# Altium schematic sheet sch.SchDoc
size A
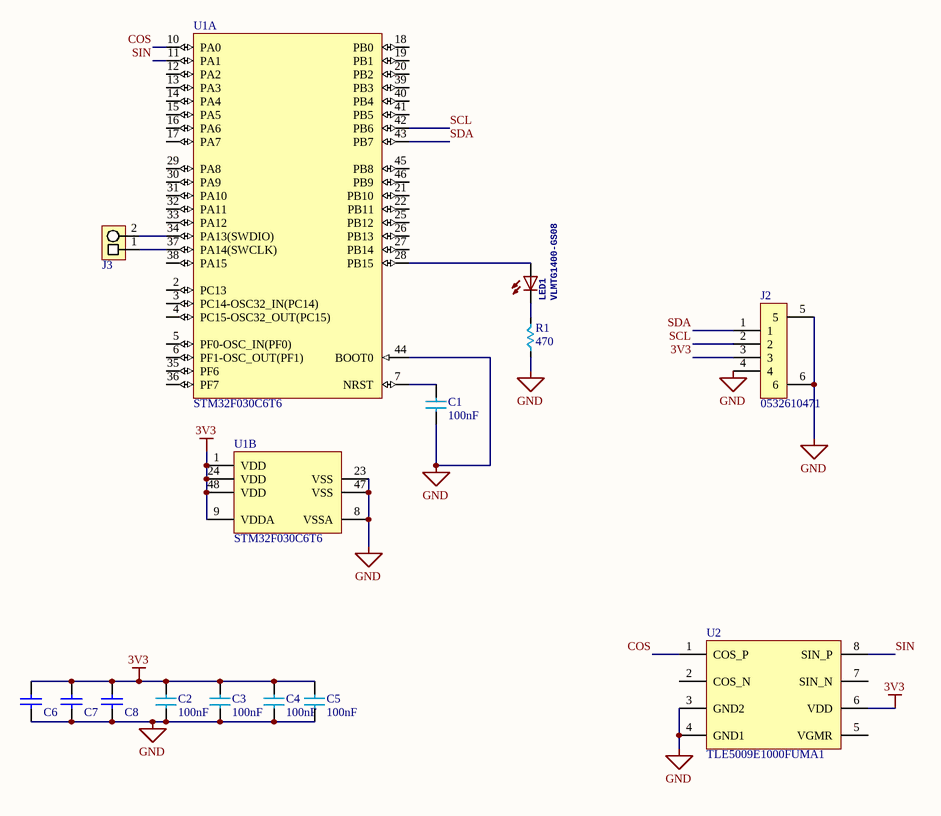
[diagram p0: sch.SchDoc]

## Parts
C1  100nF  [c0402]
C2  100nF  [c0402]
C3  100nF  [c0402]
C4  100nF  [c0402]
C5  100nF  [c0402]
C6  4.7uF  [C0603]  (value not drawn)
C7  4.7uF  [C0603]  (value not drawn)
C8  4.7uF  [C0603]  (value not drawn)
J2  0532610471  [0532610471]
J3  PIN-DUAL  [PAD-DOUBLE]  (value not drawn)
LED1  VLMTG1400-GS08  [LED_0603]
R1  470  [R0402]
U1  STM32F030C6T6  [LQFP48]  (parts A,B of 2)
U2  TLE5009E1000FUMA1  [SOIC127P600X175-8L]

## Nets
3V3: C2.1 C3.1 C4.1 C5.1 C6.2 C7.2 C8.2 J2.3 U1.1(VDD) U1.9(VDDA) U1.24(VDD) U1.48(VDD) U2.6(VDD)
GND: C1.2 C2.2 C3.2 C4.2 C5.2 C6.1 C7.1 C8.1 J2.4 J2.5 J2.6 R1.2 U1.8(VSSA) U1.23(VSS) U1.44(BOOT0) U1.47(VSS) U2.3(GND2) U2.4(GND1)
COS: U1.10(PA0) U2.1(COS_P)
SCL: J2.2 U1.42(PB6)
SDA: J2.1 U1.43(PB7)
SIN: U1.11(PA1) U2.8(SIN_P)
NetC1_1: C1.1 U1.7(NRST)
NetJ3_1: J3.1 U1.37(PA14(SWCLK))
NetJ3_2: J3.2 U1.34(PA13(SWDIO))
NetLED1_A: LED1.A U1.28(PB15)
NetLED1_C: LED1.C R1.1

Not connected (* = marked no-connect by the designer): U1 2(PC13) 3(PC14-OSC32_IN(PC14)) 4(PC15-OSC32_OUT(PC15)) 5(PF0-OSC_IN(PF0)) 6(PF1-OSC_OUT(PF1)) 12(PA2) 13(PA3) 14(PA4) 15(PA5) 16(PA6) 17(PA7) 18(PB0) 19(PB1) 20(PB2) 21(PB10) 22(PB11) 25(PB12) 26(PB13) 27(PB14) 29(PA8) 30(PA9) 31(PA10) 32(PA11) 33(PA12) 35(PF6) 36(PF7) 38(PA15) 39(PB3) 40(PB4) 41(PB5) 45(PB8) 46(PB9); U2 2(COS_N) 5(VGMR) 7(SIN_N)

## Notes on the sheet
- Title
- Size:
- Date:
- A
- Number:
- Time:
- Revision:
- Sheet
- of
- File:

## Library data of the parts
C1-C5 = C0402-100nF: SAMSUNG ELECTRO-MECHANICS - CL05F104ZO5NNNC - SMD Multilayer Ceramic Capacitor, 0.1 µF, 16 V, 0402 [1005 Metric], +80%, -20%, Y5V, CL Series; Tolerance: 80%; Voltage Rating: 16V; Supplier 1: Digi-Key; Supplier Part Number 1: 1276-1004-1-ND; Manufacturer: Samsung; Manufacturer Part Number: CL05F104ZO5NNNC; Mount: Surface Mount; Case/Package: 0402; Case Code (Metric): 1005; Case Code (Imperial): 0402; Material: Ceramic; Contact Plating: Tin; Min Operating Temperature: -30°C; Max Operating Temperature: 85°C; Capacitance: 100nF; Dielectric: Y5V; Packaging: Tape and Reel; Length: 1mm; Height: 0.5mm; Width: 0.02inch; Thickness: 0.022inch; Depth: 0.5mm; Radiation Hardening: No; ComponentLink1URL: https://datasheet.ciiva.com/16199/cl05f104zo5nnnc-16199056.pdf?src-supplier=Future+Electronics; ComponentLink1Description: https://datasheet.ciiva.com/16199/cl05f104zo5nnnc-16199056.pdf?src-supplier=Future+Electronics; ComponentLink2URL: https://datasheet.ciiva.com/15195/getdatasheetpartid-358403-15195703.pdf?src-supplier=Verical; ComponentLink2Description: https://datasheet.ciiva.com/15195/getdatasheetpartid-358403-15195703.pdf?src-supplier=Verical; ComponentLink3URL: https://datasheet.ciiva.com/29198/458504-da-01-en-vs-kondensator-0402-29198386.pdf?src-supplier=Conrad; ComponentLink3Description: https://datasheet.ciiva.com/29198/458504-da-01-en-vs-kondensator-0402-29198386.pdf?src-supplier=Conrad; RoHS: Yes; Category: Ceramic Capacitors; Stock 1: 4278518; Pricing 1: 1=0.10000, 10=0.01900, 50=0.01040, 100=0.00850, 500=0.00604, 1000=0.00475, 2500=0.00432, 5000=0.00397 (USD)
C6-C8 = C0603-4.7uF: Cap Ceramic 4.7uF 6.3VDC X5R 10% SMD 0603 Paper T/R; Manufacturer: Samsung; Manufacturer Part Number: CL10A475KQ8NNNC; Tolerance: 20%; Voltage Rating: 6.3V; Supplier 1: Digi-Key; RoHS: Yes; Category: Ceramic Capacitors; Stock 1: 1192818; Pricing 1: 1=0.10000, 10=0.04500, 50=0.02480, 100=0.02030, 500=0.01448, 1000=0.01137 (USD); Mount: Surface Mount; Case/Package: 0603; Case Code (Metric): 1608; Case Code (Imperial): 0603; Min Operating Temperature: -55°C; Max Operating Temperature: 85°C; Packaging: Tape and Reel; Package Quantity: 1; Capacitance: 4.7uF; Dielectric: X5R; Length: 1.6mm; Thickness: 0.035inch; Depth: 0.8mm; Width: 0.031inch; ComponentLink1URL: https://datasheet.ciiva.com/15195/getdatasheetpartid-358620-15195714.pdf?src-supplier=Verical; ComponentLink1Description: https://datasheet.ciiva.com/15195/getdatasheetpartid-358620-15195714.pdf?src-supplier=Verical; Supplier Part Number 1: 1276-1045-1-ND; Material: Ceramic; Contact Plating: Tin; Voltage: 6.3V; Height: 0.8mm; Radiation Hardening: No; ComponentLink2URL: https://datasheet.ciiva.com/29198/457675-da-01-en-vs-kondensator-0603-29198672.pdf?src-supplier=Conrad; ComponentLink2Description: https://datasheet.ciiva.com/29198/457675-da-01-en-vs-kondensator-0603-29198672.pdf?src-supplier=Conrad; ComponentLink3URL: https://datasheet.ciiva.com/16437/cl05b104kq5nnnc-16437321.pdf?src-supplier=Future+Electronics; ComponentLink3Description: https://datasheet.ciiva.com/16437/cl05b104kq5nnnc-16437321.pdf?src-supplier=Future+Electronics
J2 = 0532610471: Headers & Wire Housings 1.25MM HDR 4 CKT Right-Angle; Manufacturer: Molex; Manufacturer Part Number: 53261-0471; Contact Resistance: 20mR; Number of Positions: 4; Current Rating: 1A; Voltage Rating (AC): 125V; Insulation Resistance: 100MR; Gender: Male; Glow Wire Compliant: Non-compliant; Supplier 1: Digi-Key; Supplier Part Number 1: WM7622DKR-ND; Description 1: Headers & Wire Housings 1.25MM HDR 4 CKT Right-Angle; Stock: 42057; Pricing: 1=1.24, 10=1.089, 100=0.9397, 500=0.76884 (USD); Mount: Surface Mount; Contact Plating: Tin; Contact Material: Bronze,Tin; Color: Beige; Housing Material: Thermoplastic; Min Operating Temperature: -40°C; Max Operating Temperature: 85°C; Orientation: Right Angle; Number of Rows: 1; Packaging: Tape and Reel; Termination: SMD/SMT; Number of Contacts: 4; Voltage Rating: 125V; Package Quantity: 1000; Working Voltage: 125V; Number of Circuits: 4; Voltage Rating (DC): 125V; Pitch: 1.25mm; Lead Pitch: 1.25mm; Radiation Hardening: No; Flammability Rating: UL94 V-0; REACH SVHC: Unknown; Lead Free: Lead Free; ComponentLink1URL: http://www.mouser.com/ds/2/276/0532610471_PCB_HEADERS-170942.pdf; ComponentLink1Description: http://www.mouser.com/ds/2/276/0532610471_PCB_HEADERS-170942.pdf; ComponentLink2URL: http://uk.rs-online.com/webdocs/1380/0900766b8138010d.pdf; ComponentLink2Description: http://uk.rs-online.com/webdocs/1380/0900766b8138010d.pdf; ComponentLink3URL: http://www.farnell.com/datasheets/1867384.pdf; ComponentLink3Description: http://www.farnell.com/datasheets/1867384.pdf; ComponentLink4URL: http://www.molex.com/webdocs/datasheets/pdf/en-us/0532610471_PCB_HEADERS.pdf; ComponentLink4Description: http://www.molex.com/webdocs/datasheets/pdf/en-us/0532610471_PCB_HEADERS.pdf; ComponentLink5URL: https://www.alliedelec.com/m/d/74d14d19c60ab078e4881c4c1bd42ef7.pdf; ComponentLink5Description: https://www.alliedelec.com/m/d/74d14d19c60ab078e4881c4c1bd42ef7.pdf; ComponentLink6URL: http://www.jameco.com/Jameco/Products/ProdDS/1932555.pdf; ComponentLink6Description: http://www.jameco.com/Jameco/Products/ProdDS/1932555.pdf
LED1 = VLMTG1400-GS08: LED GREEN 0603 SMD; Manufacturer: Vishay; Lens Style: Flat; Luminous Intensity: 1400mcd; Forward Voltage: 2.85V; Test Current: 20mA; Viewing Angle: 146°; Dominant Wavelength: 525nm; Lens Size: 0.8mm; Supplier 1: Digi-Key; Manufacturer Part Number: VLMTG1400-GS08; RoHS: No; Category: LEDs; Stock 1: 1146; Pricing 1: 1=0.48000, 10=0.34300, 100=0.22400, 500=0.16100, 1000=0.12600 (USD); Mount: Surface Mount; Case/Package: 0603; Color: Green; Case Code (Imperial): 0603; Case Code (Metric): 1608; Packaging: Cut Tape; Length: 1.6mm; Height: 0.65mm; Width: 0.8mm; ComponentLink1URL: http://www.farnell.com/datasheets/2614507.pdf?src-supplier=Farnell; ComponentLink1Description: http://www.farnell.com/datasheets/2614507.pdf?src-supplier=Farnell; ComponentLink2URL: http://www.vishay.com/docs/84393/vlmtg1400.pdf?src-supplier=Digi-Key; ComponentLink2Description: http://www.vishay.com/docs/84393/vlmtg1400.pdf?src-supplier=Digi-Key; Supplier Part Number 1: VLMTG1400-GS08CT-ND
R1 = RC0402JR-07470RL: RES 680 OHM 5% 1/16W 0402; Manufacturer: Yageo; Description 1: RES SMD 470 OHM 5% 1/16W 0402; Resistance: 470R; Power Rating: 62.5mW; Voltage Rating: 50V; Temperature Coefficient: 100ppm/°C; Max Power Dissipation: 63mW; Value: 470; Supplier 1: Digi-Key; Supplier Part Number 1: 311-470JRDKR-ND; Manufacturer Part Number: RC0402JR-07470RL; Stock: 2903670; Pricing: 1=0.1, 10=0.013, 100=0.0055, 1000=0.00245, 2500=0.00212, 5000=0.00176 (USD); Case/Package: 0402; Case Code (Metric): 1005; Case Code (Imperial): 0402; Min Operating Temperature: -55°C; Max Operating Temperature: 155°C; Composition: Thick Film; Tolerance: 5%; Packaging: Tape and Reel; Package Quantity: 1; Number of Terminations: 2; Termination: SMD/SMT; Military Standard: Not; Working Voltage: 50V; Features: Moisture Resistant; Length: 1mm; Height: 0.016inch; Width: 0.02inch; Depth: 0.5mm; REACH SVHC: Unknown; Lead Free: Lead Free; ComponentLink1URL: http://www.yageo.com/documents/recent/PYu-RC_Group_51_RoHS_L_10.pdf?src-supplier=Digi-Key; ComponentLink1Description: http://www.yageo.com/documents/recent/PYu-RC_Group_51_RoHS_L_10.pdf?src-supplier=Digi-Key; ComponentLink2URL: http://www.farnell.com/datasheets/1018594.pdf?src-supplier=Element14; ComponentLink2Description: http://www.farnell.com/datasheets/1018594.pdf?src-supplier=Element14; ComponentLink3URL: http://www.mouser.com/ds/2/447/PYu-RC0402_51_RoHS_L_6_r-8721.pdf?src-supplier=Mouser; ComponentLink3Description: http://www.mouser.com/ds/2/447/PYu-RC0402_51_RoHS_L_6_r-8721.pdf?src-supplier=Mouser; Supplier 2: Digi-Key; RoHS: Yes; Category: Chip SMD Resistors; Stock 2: 241664; Pricing 2: 1=0.10000, 10=0.01100, 100=0.00450, 1000=0.00204, 2500=0.00177, 5000=0.00146 (USD); Mount: Surface Mount; Contact Plating: Tin,Matte; Radiation Hardening: No; ComponentLink4URL: https://www.seielect.com/catalog/SEI-Packaging.pdf?src-supplier=Digi-Key; ComponentLink4Description: https://www.seielect.com/catalog/SEI-Packaging.pdf?src-supplier=Digi-Key; ComponentLink5URL: https://www.seielect.com/catalog/SEI-RMCF_RMCP.pdf?src-supplier=Avnet; ComponentLink5Description: https://www.seielect.com/catalog/SEI-RMCF_RMCP.pdf?src-supplier=Avnet; ComponentLink6URL: http://www.seielect.com/Catalog/SEI-RMC.pdf?src-supplier=Future+Electronics; ComponentLink6Description: http://www.seielect.com/Catalog/SEI-RMC.pdf?src-supplier=Future+Electronics; Supplier Part Number 2: RMCF0402JT680RCT-ND
U1 = STM32F030C6T6: STMICROELECTRONICS - STM32F030C6T6 - ARM MCU, Value Line, STM32 Family STM32F0 Series Microcontrollers, ARM Cortex-M0, 32bit, 48 MHz - ARM MCU, Value Line, STM32 Family STM32F0 Series Microcontrollers, ARM Cortex-M0, 32bit, 48 MHz; FLASH Size (Prog) (kB): 32; I/Os (High Current): 39; Internal RAM Size (kB): 4; Operating Frequency(F) (Processor speed) (MHz): 48; Packing: Tray; Supply Voltage(Vcc) min (V): 2.4; Interface: I2C,SPI,UART,USART; Number of Timers/Counters: 5; Max Supply Voltage: 3.6V; RAM Size: 4KB; Max Power Dissipation: 364mW; Frequency: 48MHz; Min Supply Voltage: 2.4V; Number of ADC Channels: 16; Oscillator Type: Internal; Data Bus Width: 32b; Watchdog Timer: Yes; Memory Type: FLASH; Memory Size: 32KB; Peripherals: POR,PWM,WDT,DMA; Number of SPI Channels: 1; Number of PWM Channels: 6; DatasheetVersion: Rev. 1; PackageVersion: Rev. 6, 06/2013; PackageReference: LQFP48; PackageDescription: 48-Pin Low Profile Quad Flat Package, 7 x 7 mm Body, 0.5 mm Pitch; Supplier 1: Digi-Key; Supplier Part Number 1: 497-14042-ND; Supplier 2: Newark; Supplier Part Number 2: 06X3646; Supplier 3: Mouser; Supplier Part Number 3: 511-STM32F030C6T6; Core: ARM Cortex-M0; Mounting Technology: Surface Mount; PartNumber: STM32F030C6T6; ComponentLink1Description: Manufacturer URL; ComponentLink1URL: http://www.st.com/web/en/home.html; ComponentLink2Description: Datasheet; ComponentLink2URL: http://www.st.com/st-web-ui/static/active/en/resource/technical/document/datasheet/DM00088500.pdf; ComponentLink3Description: Package Specification; ComponentLink3URL: http://www.st.com/st-web-ui/static/active/en/resource/technical/document/datasheet/DM00058181.pdf; Manufacturer: STMicroelectronics; Manufacturer Part Number: STM32F030C6T6; RoHS: Yes; Category: Microcontrollers; Stock 1: 262; Pricing 1: 1=1.48000, 10=1.32900, 25=1.25400, 100=1.06840, 250=1.00320, 500=0.87780, 1000=0.72732, 2500=0.67716, 5000=0.65208 (USD); Case/Package: LQFP; Number of Pins: 48; Contact Plating: Tin,Matte; Min Operating Temperature: -40°C; Max Operating Temperature: 85°C; Number of I/Os: 39; Package Quantity: 250; Packaging: Tray; Number of Programmable I/O: 39; Max Frequency: 48MHz; Core Architecture: ARM; Number of I2C Channels: 1; Length: 7.2mm; Height: 1.45mm; Width: 7.2mm; Radiation Hardening: No; Lead Free: Lead Free; REACH SVHC: No SVHC; ComponentLink4URL: https://datasheet.ciiva.com/29720/dm00088500-29720640.pdf?src-supplier=Avnet; ComponentLink4Description: https://datasheet.ciiva.com/29720/dm00088500-29720640.pdf?src-supplier=Avnet; ComponentLink5URL: https://datasheet.ciiva.com/28647/1883133-28647788.pdf?src-supplier=Element14; ComponentLink5Description: https://datasheet.ciiva.com/28647/1883133-28647788.pdf?src-supplier=Element14
U2 = TLE5009E1000FUMA1: RotaryPosition Sensor 5.5V Automotive 8-Pin DSO Tape and Reel; Manufacturer: Infineon; Operating Supply Voltage: 3.3V; Interface: Analog; Sensing Method: Magnetoresistive; Supplier 1: Digi-Key; Manufacturer Part Number: TLE5009E1000FUMA1; RoHS: Yes; Category: Sensors; Stock 1: 2450; Pricing 1: 1=3.40000, 5=3.15600, 10=2.62200, 25=2.18480, 50=1.94220, 100=1.84510, 500=1.55372, 1000=1.45662 (USD); Mount: Surface Mount; Case/Package: SMD/SMT; Number of Pins: 8; Min Operating Temperature: -40°C; Max Operating Temperature: 150°C; Termination: SMD/SMT; Lead Free: Lead Free; Halogen Free: Not Halogen Free; ComponentLink1URL: http://components.arrow.com/part/dataview/52121057S8968538N2051?src-supplier=Arrow; ComponentLink1Description: http://components.arrow.com/part/dataview/52121057S8968538N2051?src-supplier=Arrow; ComponentLink2URL: http://components.arrow.com/part/dataview/0323_03444430?src-supplier=Arrow+Europe; ComponentLink2Description: http://components.arrow.com/part/dataview/0323_03444430?src-supplier=Arrow+Europe; ComponentLink3URL: http://www.infineon.com/dgdl/Infineon-TLE5009_FDS-DS-v01_01-en.pdf?fileId=db3a304330f686060131421d8ddd56b0&src-supplier=Digi-Key; ComponentLink3Description: http://www.infineon.com/dgdl/Infineon-TLE5009_FDS-DS-v01_01-en.pdf?fileId=db3a304330f686060131421d8ddd56b0&src-supplier=Digi-Key; ComponentLink4URL: http://www.infineon.com/dgdl/TLE5009_PDS_Rev0.9.pdf?folderId=db3a30431ce5fb52011d3dd6e8012582&fileId=db3a304330f686060131421d8ddd56b0&src-supplier=Avnet; ComponentLink4Description: http://www.infineon.com/dgdl/TLE5009_PDS_Rev0.9.pdf?folderId=db3a30431ce5fb52011d3dd6e8012582&fileId=db3a304330f686060131421d8ddd56b0&src-supplier=Avnet; Supplier Part Number 1: TLE5009E1000FUMA1CT-ND